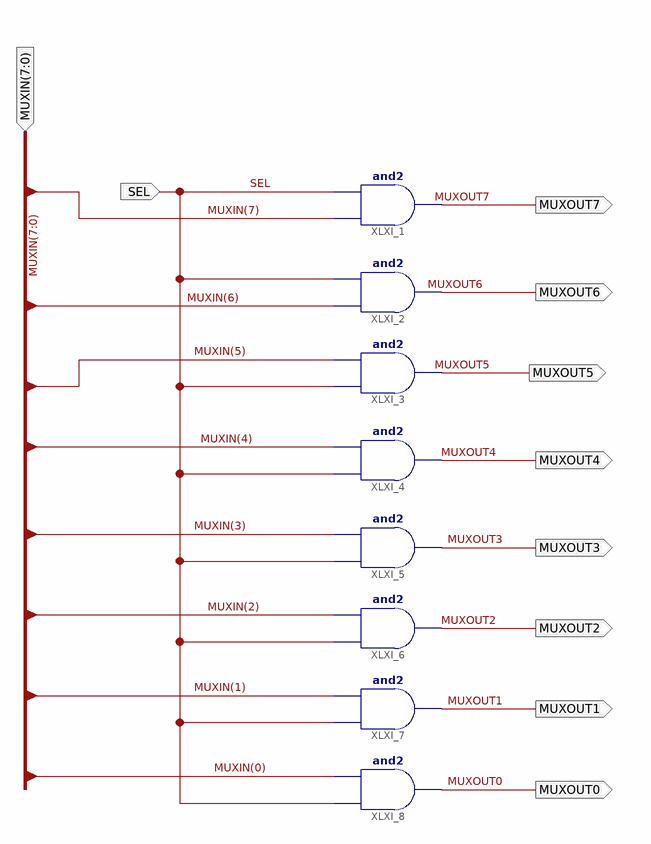
[diagram p0: schematic sheet 1]
// Xilinx ISE schematic enoutput8_sch.sch (spartan2e) as structural Verilog: 8 symbols, 10 ports
module enoutput8_sch (
  input  SEL,
  input  [7:0] MUXIN,
  output MUXOUT7,
  output MUXOUT6,
  output MUXOUT5,
  output MUXOUT4,
  output MUXOUT3,
  output MUXOUT2,
  output MUXOUT1,
  output MUXOUT0
);

  and XLXI_1 (MUXOUT7, MUXIN[7], SEL);
  and XLXI_2 (MUXOUT6, MUXIN[6], SEL);
  and XLXI_3 (MUXOUT5, SEL, MUXIN[5]);
  and XLXI_4 (MUXOUT4, SEL, MUXIN[4]);
  and XLXI_5 (MUXOUT3, SEL, MUXIN[3]);
  and XLXI_6 (MUXOUT2, SEL, MUXIN[2]);
  and XLXI_7 (MUXOUT1, SEL, MUXIN[1]);
  and XLXI_8 (MUXOUT0, SEL, MUXIN[0]);
endmodule
